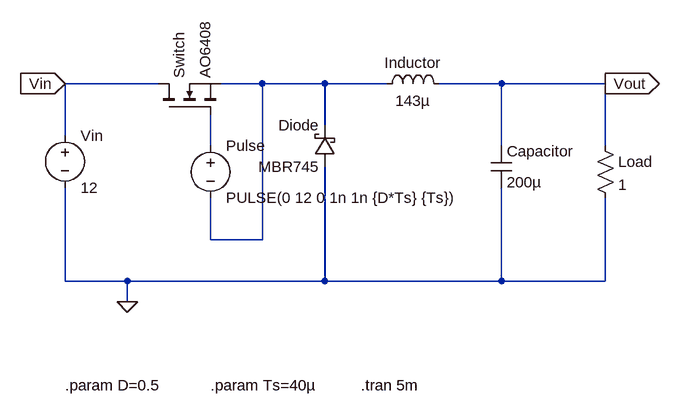
[diagram p0: schematic buck_converter.asc]
buck_converter.asc, the LTspice schematic file:
Version 4
SHEET 1 1056 680
WIRE 256 32 112 32
WIRE 416 32 352 32
WIRE 512 32 416 32
WIRE 608 32 512 32
WIRE 784 32 688 32
WIRE 944 32 784 32
WIRE 512 96 512 32
WIRE 112 112 112 32
WIRE 336 128 336 80
WIRE 784 128 784 32
WIRE 944 128 944 32
WIRE 336 272 336 208
WIRE 416 272 416 32
WIRE 416 272 336 272
WIRE 112 336 112 192
WIRE 208 336 112 336
WIRE 512 336 512 160
WIRE 512 336 208 336
WIRE 784 336 784 192
WIRE 784 336 512 336
WIRE 944 336 944 208
WIRE 944 336 784 336
WIRE 208 368 208 336
FLAG 208 368 0
FLAG 112 32 Vin
IOPIN 112 32 In
FLAG 944 32 Vout
IOPIN 944 32 Out
SYMBOL voltage 112 96 R0
WINDOW 123 0 0 Left 0
WINDOW 39 0 0 Left 0
SYMATTR InstName Vin
SYMATTR Value 12
SYMBOL nmos 256 80 R270
SYMATTR InstName Switch
SYMATTR Value AO6408
SYMBOL voltage 336 112 R0
WINDOW 123 0 0 Left 0
WINDOW 39 0 0 Left 0
SYMATTR InstName Pulse
SYMATTR Value PULSE(0 12 0 1n 1n {D*Ts} {Ts})
SYMBOL schottky 528 160 R180
WINDOW 0 24 64 Left 2
WINDOW 3 24 0 Left 2
SYMATTR InstName Diode
SYMATTR Value MBR745
SYMATTR Description Diode
SYMATTR Type diode
SYMBOL ind 592 48 R270
WINDOW 0 32 56 VTop 2
WINDOW 3 5 56 VBottom 2
SYMATTR InstName Inductor
SYMATTR Value 143µ
SYMATTR SpiceLine Rser=20m
SYMBOL cap 768 128 R0
SYMATTR InstName Capacitor
SYMATTR Value 200µ
SYMATTR SpiceLine Rser=1m
SYMBOL res 928 112 R0
SYMATTR InstName Load
SYMATTR Value 1
TEXT 112 496 Left 2 !.param D=0.5
TEXT 336 496 Left 2 !.param Ts=40µ
TEXT 568 496 Left 2 !.tran 5m

The netlist it stands for:
* buck_converter.asc
Vin Vin 0 12
M§Switch Vin N002 N001 N001 AO6408
V§Pulse N002 N001 PULSE(0 12 0 1n 1n {D*Ts} {Ts})
Diode 0 N001 MBR745
L§Inductor N001 Vout 143µ Rser=20m
Capacitor Vout 0 200µ Rser=1m
R§Load Vout 0 1
.model D D
.lib standard.dio
.model NMOS NMOS
.model PMOS PMOS
.lib standard.mos
.param D=0.5
.param Ts=40µ
.tran 5m
.backanno
.end